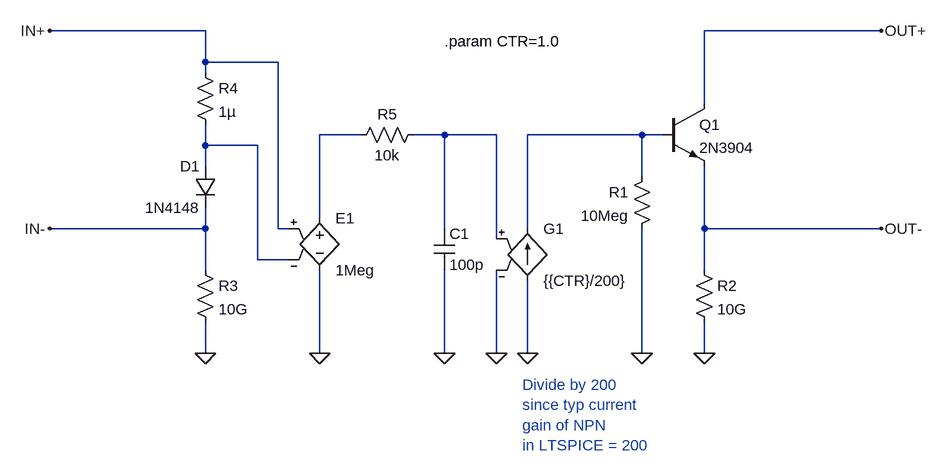
[diagram p0: schematic Discrete_Optocoupler_Test_Bench.asc]
Discrete_Optocoupler_Test_Bench.asc, the LTspice schematic file:
Version 4.1
SHEET 1 1256 680
WIRE -64 -48 -304 -48
WIRE 976 -48 704 -48
WIRE -64 0 -64 -48
WIRE 48 0 -64 0
WIRE -64 16 -64 0
WIRE 704 64 704 -48
WIRE 176 112 112 112
WIRE 304 112 256 112
WIRE 384 112 304 112
WIRE 608 112 432 112
WIRE 640 112 608 112
WIRE -64 128 -64 96
WIRE 16 128 -64 128
WIRE -64 160 -64 128
WIRE 608 176 608 112
WIRE 112 240 112 112
WIRE -64 256 -64 224
WIRE -64 256 -304 256
WIRE 48 256 48 0
WIRE 64 256 48 256
WIRE 304 256 304 112
WIRE 432 256 432 112
WIRE 704 256 704 160
WIRE 976 256 704 256
WIRE 384 272 384 112
WIRE 16 304 16 128
WIRE 64 304 16 304
WIRE -64 320 -64 256
WIRE 704 320 704 256
WIRE -64 448 -64 400
WIRE 112 448 112 320
WIRE 304 448 304 320
WIRE 384 448 384 320
WIRE 432 448 432 336
WIRE 608 448 608 256
WIRE 704 448 704 400
FLAG 704 448 0
FLAG -64 448 0
FLAG 608 448 0
FLAG 432 448 0
FLAG 384 448 0
FLAG 304 448 0
FLAG 112 448 0
FLAG -304 -48 IN+
FLAG -304 256 IN-
FLAG 976 -48 OUT+
FLAG 976 256 OUT-
SYMBOL diode -48 160 M0
SYMATTR InstName D1
SYMATTR Value 1N4148
SYMBOL res 624 160 M0
SYMATTR InstName R1
SYMATTR Value 10Meg
SYMBOL res 688 304 R0
SYMATTR InstName R2
SYMATTR Value 10G
SYMBOL res -80 304 R0
SYMATTR InstName R3
SYMATTR Value 10G
SYMBOL npn 640 64 R0
SYMATTR InstName Q1
SYMATTR Value 2N3904
SYMBOL g 432 240 R0
SYMATTR InstName G1
SYMATTR Value {{CTR}/200}
SYMBOL cap 288 256 R0
SYMATTR InstName C1
SYMATTR Value 100p
SYMBOL res 272 96 R90
WINDOW 0 0 56 VBottom 2
WINDOW 3 32 56 VTop 2
SYMATTR InstName R5
SYMATTR Value 10k
SYMBOL res -80 0 R0
SYMATTR InstName R4
SYMATTR Value 1µ
SYMBOL e 112 224 R0
SYMATTR InstName E1
SYMATTR Value 1Meg
TEXT 304 -32 Left 2 !.param CTR=1.0
TEXT 424 496 Left 2 ;Divide by 200\nsince typ current\ngain of NPN\nin LTSPICE = 200

The netlist it stands for:
* Discrete_Optocoupler_Test_Bench.asc
D1 N004 IN- 1N4148
R1 N003 0 10Meg
R2 OUT- 0 10G
R3 IN- 0 10G
Q1 OUT+ N003 OUT- 0 2N3904
G1 0 N003 N002 0 {{CTR}/200}
C1 N002 0 100p
R5 N002 N001 10k
R4 IN+ N004 1µ
E1 N001 0 IN+ N004 1Meg
.model D D
.lib standard.dio
.model NPN NPN
.model PNP PNP
.lib standard.bjt
.param CTR=1.0
* Divide by 200
* since typ current
* gain of NPN
* in LTSPICE = 200
.backanno
.end